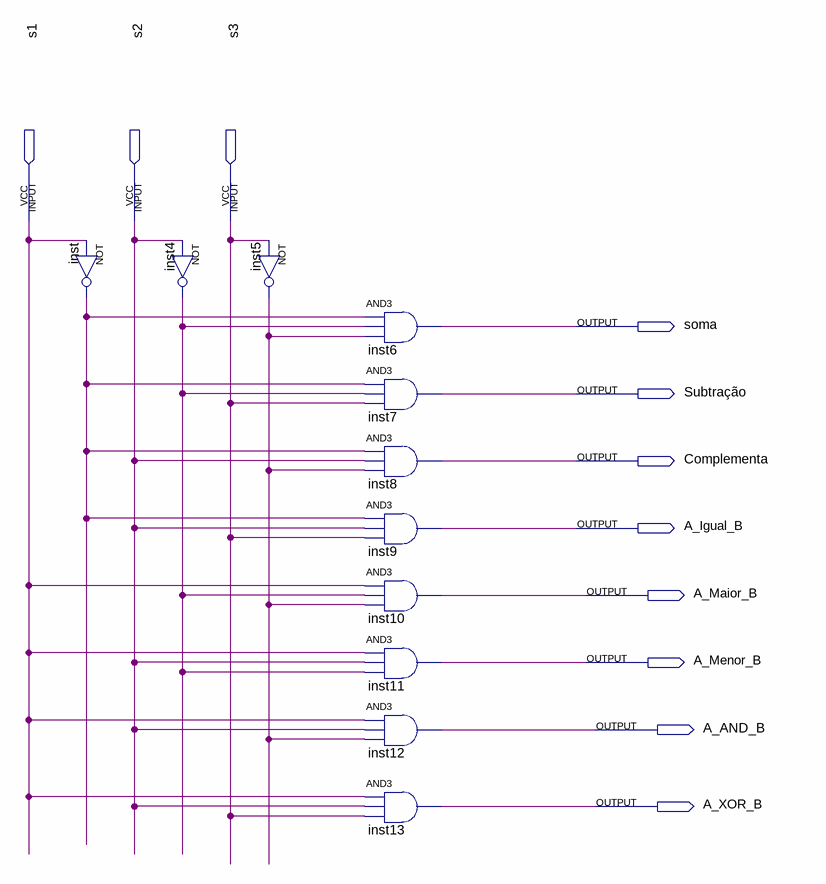
[diagram p0: schematic sheet]
// Quartus schematic Decodificador.bdf as structural Verilog: 11 symbols, 11 pins
module Decodificador (
  input  s1,
  input  s2,
  input  s3,
  output soma,
  output \Subtração ,
  output Complementa,
  output A_Igual_B,
  output A_Maior_B,
  output A_Menor_B,
  output A_AND_B,
  output A_XOR_B
);

  wire inst4_out, inst5_out, inst_out;

  not inst (inst_out, s1);
  not inst4 (inst4_out, s2);
  not inst5 (inst5_out, s3);
  and inst6 (soma, inst_out, inst4_out, inst5_out);
  and inst7 (\Subtração , inst_out, inst4_out, s3);
  and inst8 (Complementa, inst_out, s2, inst5_out);
  and inst9 (A_Igual_B, inst_out, s2, s3);
  and inst10 (A_Maior_B, s1, inst4_out, inst5_out);
  and inst11 (A_Menor_B, s1, s2, inst4_out);
  and inst12 (A_AND_B, s1, s2, inst5_out);
  and inst13 (A_XOR_B, s1, s2, s3);
endmodule
